# EAGLE design initial_schematic (EAGLE 9.2.2)
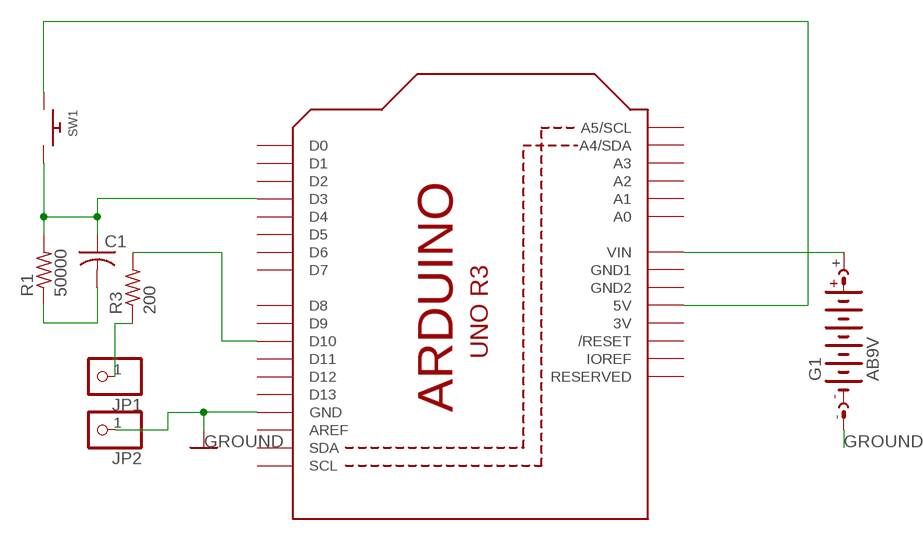
[diagram p0: schematic, sheet 1]

## Parts
C1  C-USC0805  [C0805]
G1  AB9V  [AB9V]
JP1  PINHD-1X1  [1X01]
JP2  PINHD-1X1  [1X01]
R1  50000  R-US_R0805W  [R0805W]
R3  200  R-US_R0805W  [R0805W]
SW1  SWITCH_PUSHBUTTONC&K_KSS  [BTN_CK_KSS]
U1  ARDUINOR3-DIMENSION  [ARDUINOR3]

## Nets
GROUND: JP2.1 U1.GND ; supply symbol labelled GND
N$1: G1.+ U1.VIN
N$2: SW1.P$1 U1.5V
N$3: R3.2 U1.D10
N$4: C1.1 R1.2 SW1.P$2 U1.D3
N$5: C1.2 R1.1
N$6: G1.-
N$7: JP1.1 R3.1
Unconnected: U1.A0 U1.A1 U1.A2 U1.A3 U1.A4(A4/SDA) U1.A5(A5/SCL) U1.AREF U1.D0 U1.D1 U1.D2 U1.D4 U1.D5 U1.D6 U1.D7 U1.D8 U1.D9 U1.D11 U1.D12 U1.D13 U1.IOREF U1.RESERVED U1.RESET(/RESET) U1.SCL U1.SDA

## Power pins joined to a net without a drawn wire
3V: U1.3V
GND1: U1.GND1
GND2: U1.GND2

## Library data of the parts
C1 = adafruit:C-US: CAPACITOR, American symbol
G1 = battery:AB9V: 9-V BATTERY CLIP
JP1 JP2 = adafruit:PINHD-1X1: Pin header 1x1 for 0.1" spacing With round pins
R1 R3 = adafruit:R-US_: RESISTOR, American symbol
SW1 = adafruit:SWITCH_PUSHBUTTON: Buttons SOFTTOUCHSMD_SJ - Soft touch temporary push button (Super Junk Akihabara) Compatible with SKPMANE010 [Mouser: 688-SKPMAN] C&K_KSS = Digikey: KSS221GLFS
U1 = adafruit:ARDUINOR3: This is a new object for the new Arduino R3 - with extra pins that you may want to use (such as IOref, and duplicated A4/A5

## Net classes
0 default: width 0.508 mm, clearance 0.305 mm

## Board
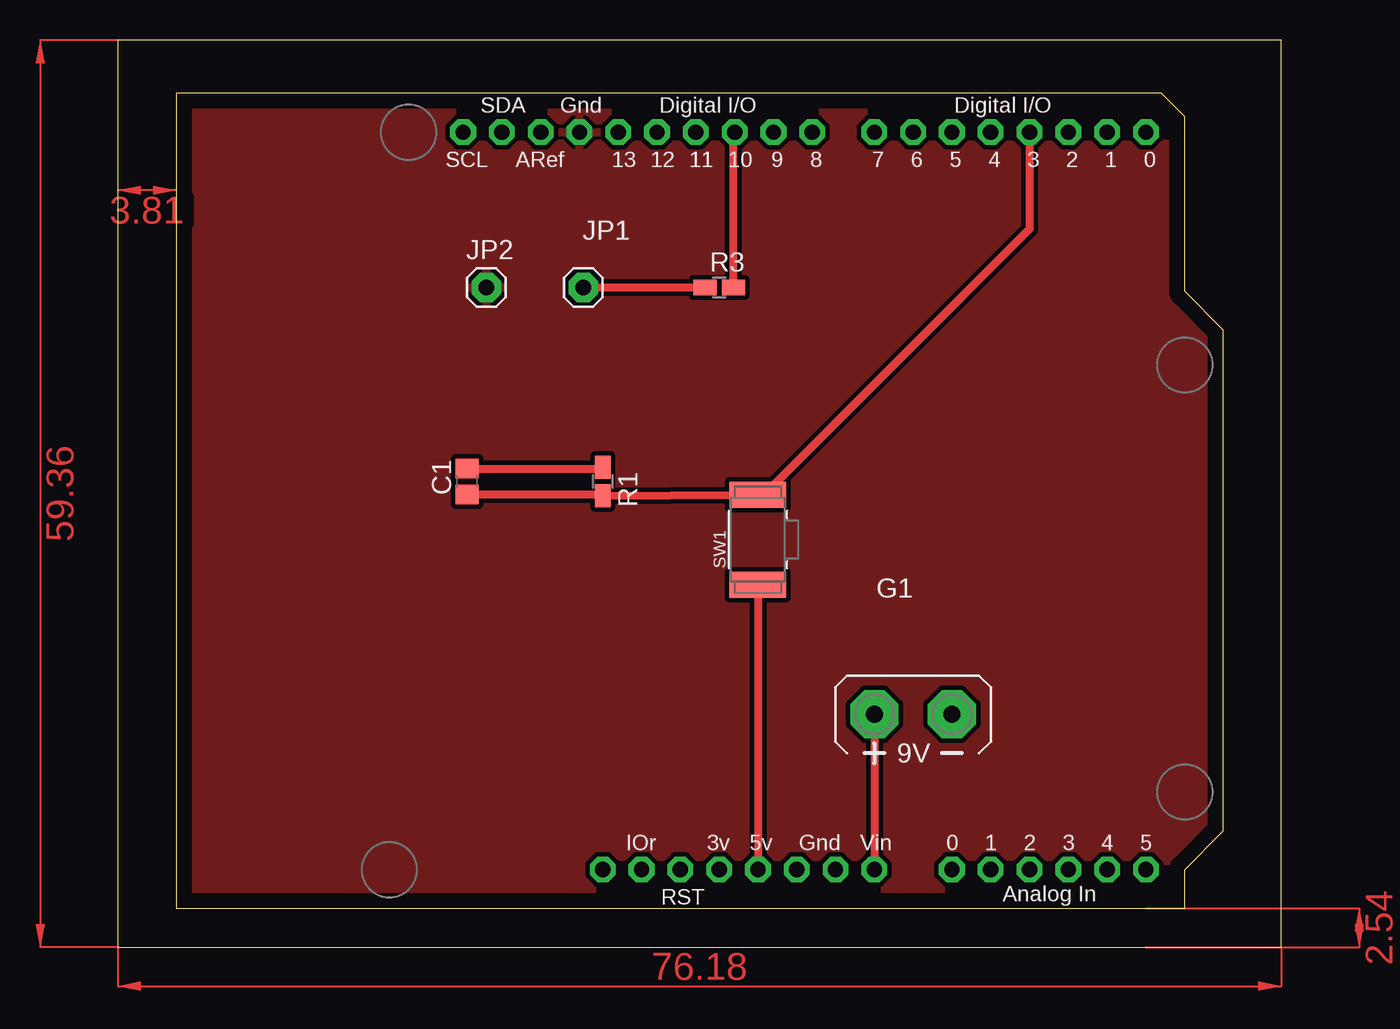
[diagram p1: board, top side]

Size 76.18 x 59.36 mm. Coordinates in mm from the lower left corner, seen from the top.
Outline: 0,0 76.18,0 76.18,59.36 0,59.36 0,0
Copper layers (1*16): Top 0.035mm / dielectric 1.5mm / Bottom 0.035mm
Design rules "default": minimum track width 6mil, minimum drill 0.35mm, track to track 6mil, track to pad 6mil, pad to pad 6mil, via to via 6mil, smd to smd 6mil, copper to edge 40mil, drill to drill 6mil, minimum pad ring 10mil, minimum via ring 8mil, stop-mask expansion 4mil, vias tented up to drill 0mil, thermal gap 10mil

### Footprints (pad centres in the part's own frame; a part is rotated, then mirrored left to right if it is on the bottom)
C0805 = smd 1.3 x 1.5: 1 -0.85,0; 2 0.85,0
AB9V = drill 1.118 pad 3.15 octagon: + 0,2.54; - 0,-2.54
1X01 = drill 1.016 pad 1.93 octagon: 1 0,0
R0805W = smd 1.5 x 1: 1 -0.94,0; 2 0.94,0
BTN_CK_KSS = smd 1.7 x 3.7: P$1 -2.95,0; P$2 2.95,0
ARDUINOR3 = drill 1 pad 1.676 octagon: 3V 35.56,2.54; 5V 38.1,2.54; A0 50.8,2.54; A1 53.34,2.54; A2 55.88,2.54; A3 58.42,2.54; A4 60.96,2.54; A5 63.5,2.54; AREF 23.876,50.8; D0 63.5,50.8; D1 60.96,50.8; D2 58.42,50.8; D3 55.88,50.8; D4 53.34,50.8; D5 50.8,50.8; D6 48.26,50.8; D7 45.72,50.8; D8 41.656,50.8; D9 39.116,50.8; D10 36.576,50.8; D11 34.036,50.8; D12 31.496,50.8; D13 28.956,50.8; GND 26.416,50.8; GND1 43.18,2.54; GND2 40.64,2.54; IOREF 30.48,2.54; RESERVED 27.94,2.54; RESET 33.02,2.54; SCL 18.796,50.8; SDA 21.336,50.8; VIN 45.72,2.54

### Placement (x,y rotation side)
C1  22.86,30.48 90 top
G1  52.07,15.24 90 top
JP1  30.48,43.18 0 top
JP2  24.13,43.18 0 top
R1  31.75,30.48 270 top
R3  39.37,43.18 0 top
SW1  41.91,26.67 90 top
U1  3.81,2.54 0 top

### Tracks (layer width: path | path; a pad name or v marks a point on that pad's centre or on a via)
GROUND
  Top 0.508: U1.GND 30.48,53.09
  pour Top: 2.54,57.15 71.12,57.15 74.93,41.91 74.93,1.27 1.27,1.27
N$1
  Top 0.508: G1.+ U1.VIN
N$2
  Top 0.508: SW1.P$1 U1.5V
N$3
  Top 0.508: R3.2 40.31,53.26 U1.D10
N$4
  Top 0.152: 31.66,29.63 R1.2
  Top 0.508: U1.D3 59.69,46.99 41.91,29.21 SW1.P$2 40.64,29.61 R1.2 | C1.1 31.66,29.63
N$5
  Top 0.152: 31.66,31.33 R1.1
  Top 0.508: C1.2 31.66,31.33
N$7
  Top 0.152: R3.1 38.27,43.34 38.1,43.51
  Top 0.508: JP1.1 38.1,43.18 38.27,43.34
(copper drawn outside any net)
  shapes: Top area x4